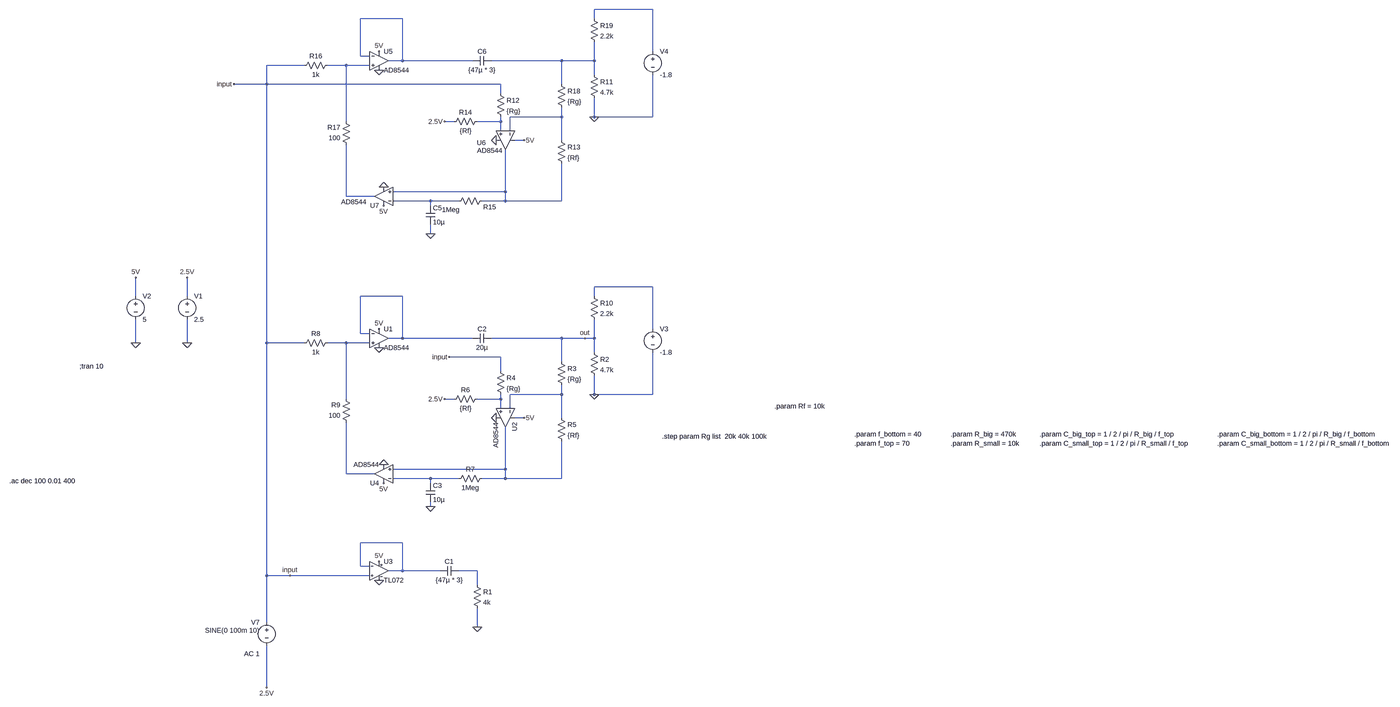
[diagram p0: schematic HP_ac_v2.asc, whole sheet]
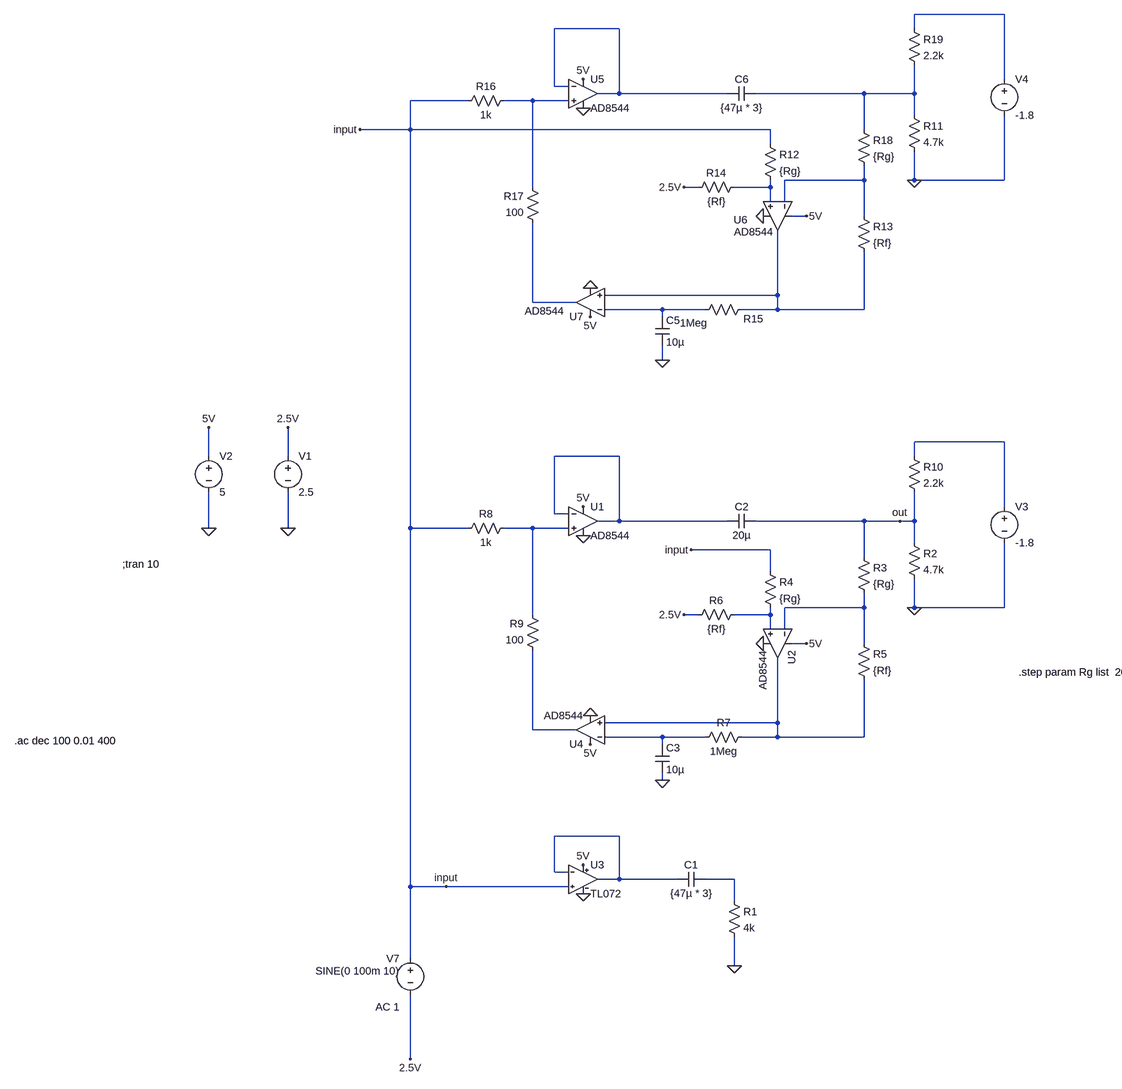
[diagram p1: schematic HP_ac_v2.asc, part, row 1 of 1, column 1 of 2]
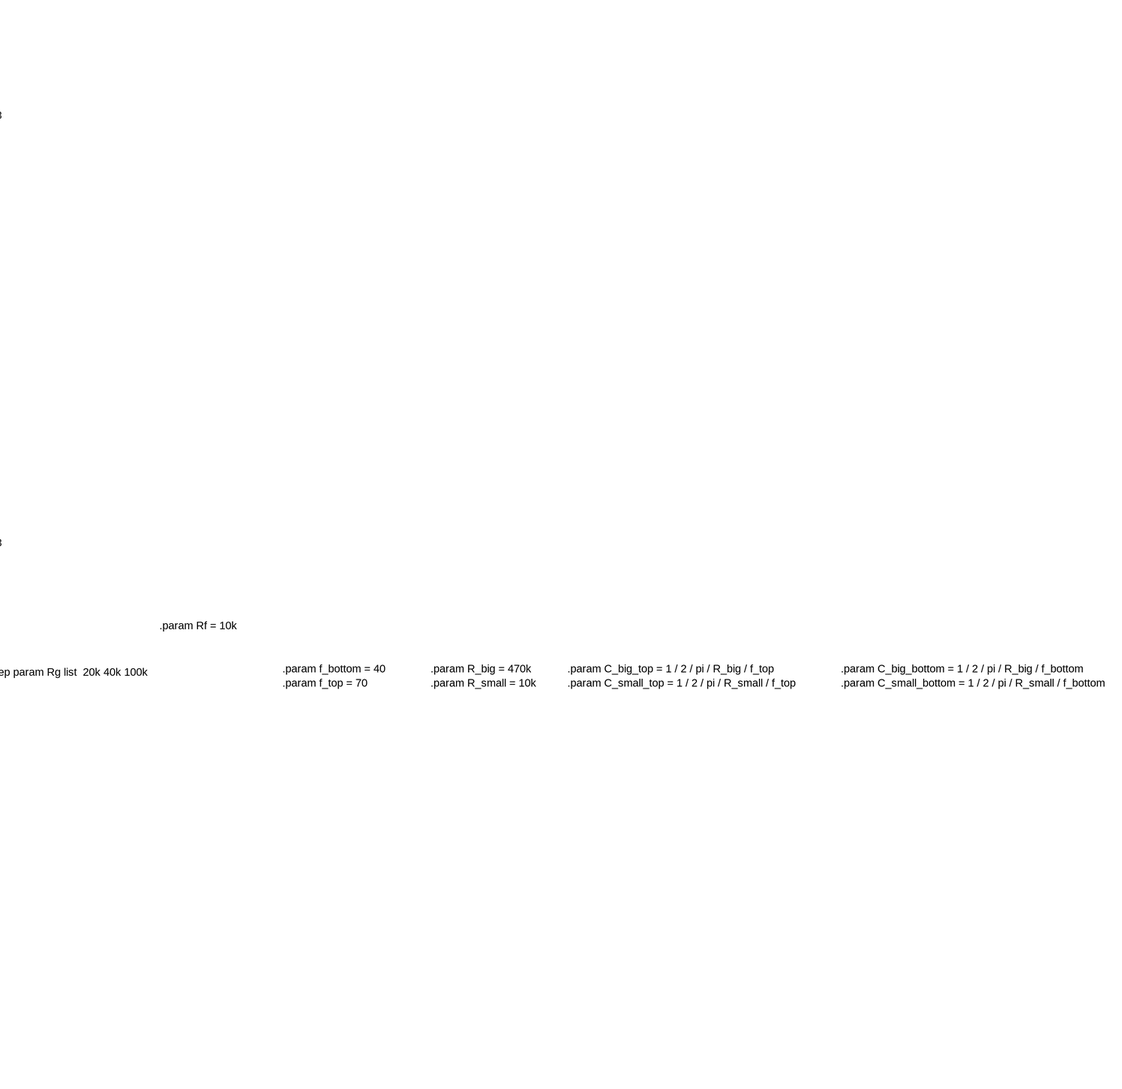
[diagram p2: schematic HP_ac_v2.asc, part, row 1 of 1, column 2 of 2]
HP_ac_v2.asc, the LTspice schematic file:
Version 4
SHEET 1 3144 1716
WIRE 352 -1264 112 -1264
WIRE -544 -1232 -688 -1232
WIRE 112 -1232 112 -1264
WIRE 352 -1120 352 -1264
WIRE -688 -1104 -688 -1232
WIRE -656 -1104 -688 -1104
WIRE -544 -1088 -544 -1232
WIRE -544 -1088 -592 -1088
WIRE -304 -1088 -544 -1088
WIRE 0 -1088 -240 -1088
WIRE 112 -1088 112 -1152
WIRE 112 -1088 0 -1088
WIRE -880 -1072 -1008 -1072
WIRE -736 -1072 -800 -1072
WIRE -656 -1072 -736 -1072
WIRE 112 -1040 112 -1088
WIRE -1008 -1008 -1008 -1072
WIRE -1008 -1008 -1120 -1008
WIRE -208 -1008 -1008 -1008
WIRE 0 -1008 0 -1088
WIRE -208 -976 -208 -1008
WIRE 0 -896 0 -928
WIRE 0 -896 -176 -896
WIRE 112 -896 112 -960
WIRE 112 -896 96 -896
WIRE 352 -896 352 -1040
WIRE 352 -896 112 -896
WIRE -736 -880 -736 -1072
WIRE -368 -880 -400 -880
WIRE -208 -880 -208 -896
WIRE -208 -880 -288 -880
WIRE -208 -848 -208 -880
WIRE -176 -848 -176 -896
WIRE -128 -816 -160 -816
WIRE 0 -816 0 -896
WIRE -192 -640 -192 -784
WIRE -192 -640 -576 -640
WIRE -736 -624 -736 -800
WIRE -640 -624 -736 -624
WIRE -448 -608 -576 -608
WIRE -352 -608 -448 -608
WIRE -192 -608 -192 -640
WIRE -192 -608 -272 -608
WIRE 0 -608 0 -736
WIRE 0 -608 -192 -608
WIRE -448 -592 -448 -608
WIRE -448 -496 -448 -528
WIRE 352 -304 112 -304
WIRE -1456 -272 -1456 -336
WIRE -1280 -272 -1280 -336
WIRE -544 -272 -688 -272
WIRE 112 -272 112 -304
WIRE 352 -160 352 -304
WIRE -688 -144 -688 -272
WIRE -656 -144 -688 -144
WIRE -544 -128 -544 -272
WIRE -544 -128 -592 -128
WIRE -304 -128 -544 -128
WIRE 0 -128 -240 -128
WIRE 80 -128 0 -128
WIRE 112 -128 112 -192
WIRE 112 -128 80 -128
WIRE -1456 -112 -1456 -192
WIRE -1280 -112 -1280 -192
WIRE -1008 -112 -1008 -1008
WIRE -880 -112 -1008 -112
WIRE -736 -112 -800 -112
WIRE -656 -112 -736 -112
WIRE 112 -80 112 -128
WIRE -208 -64 -384 -64
WIRE 0 -48 0 -128
WIRE -208 -16 -208 -64
WIRE 0 64 0 32
WIRE 0 64 -176 64
WIRE 112 64 112 0
WIRE 112 64 96 64
WIRE 352 64 352 -80
WIRE 352 64 112 64
WIRE -736 80 -736 -112
WIRE -368 80 -400 80
WIRE -208 80 -208 64
WIRE -208 80 -288 80
WIRE -208 112 -208 80
WIRE -176 112 -176 64
WIRE -128 144 -160 144
WIRE 0 144 0 64
WIRE -192 320 -192 176
WIRE -192 320 -576 320
WIRE -736 336 -736 160
WIRE -640 336 -736 336
WIRE -448 352 -576 352
WIRE -352 352 -448 352
WIRE -192 352 -192 320
WIRE -192 352 -272 352
WIRE 0 352 0 224
WIRE 0 352 -192 352
WIRE -448 368 -448 352
WIRE -448 448 -448 432
WIRE -544 672 -688 672
WIRE -688 752 -688 672
WIRE -656 752 -688 752
WIRE -544 768 -544 672
WIRE -544 768 -592 768
WIRE -416 768 -544 768
WIRE -288 768 -352 768
WIRE -1008 784 -1008 -112
WIRE -928 784 -1008 784
WIRE -656 784 -928 784
WIRE -288 816 -288 768
WIRE -1008 944 -1008 784
WIRE -288 960 -288 896
WIRE -1008 1184 -1008 1024
FLAG -1456 -112 0
FLAG -1456 -336 5V
FLAG -1280 -112 0
FLAG -1280 -336 2.5V
FLAG -624 800 0
FLAG -624 736 5V
FLAG -1008 1184 2.5V
FLAG -288 960 0
FLAG -624 -96 0
FLAG -624 -160 5V
FLAG 112 64 0
FLAG -928 784 input
FLAG 80 -128 out
FLAG -224 144 0
FLAG -128 144 5V
FLAG -384 -64 input
FLAG -400 80 2.5V
FLAG -448 448 0
FLAG -608 304 0
FLAG -608 368 5V
FLAG -624 -1056 0
FLAG -624 -1120 5V
FLAG 112 -896 0
FLAG -224 -816 0
FLAG -128 -816 5V
FLAG -1120 -1008 input
FLAG -400 -880 2.5V
FLAG -448 -496 0
FLAG -608 -656 0
FLAG -608 -592 5V
SYMBOL voltage -1456 -288 R0
WINDOW 123 0 0 Left 0
WINDOW 39 0 0 Left 0
SYMATTR InstName V2
SYMATTR Value 5
SYMBOL voltage -1008 928 M0
WINDOW 123 24 124 Left 2
WINDOW 39 0 0 Left 0
WINDOW 3 24 44 Left 2
SYMATTR Value2 AC 1
SYMATTR Value SINE(0 100m 10)
SYMATTR InstName V7
SYMBOL voltage -1280 -288 R0
WINDOW 123 0 0 Left 0
WINDOW 39 0 0 Left 0
SYMATTR InstName V1
SYMATTR Value 2.5
SYMBOL ZZZ\\OpAmp\\TL072 -624 768 R0
SYMATTR InstName U3
SYMBOL cap -352 752 R90
WINDOW 0 0 32 VBottom 2
WINDOW 3 32 32 VTop 2
SYMATTR InstName C1
SYMATTR Value {47µ * 3}
SYMBOL res -304 800 R0
SYMATTR InstName R1
SYMATTR Value 4k
SYMBOL cap -240 -144 R90
WINDOW 0 0 32 VBottom 2
WINDOW 3 32 32 VTop 2
SYMATTR InstName C2
SYMATTR Value 20µ
SYMBOL res 96 -96 R0
SYMATTR InstName R2
SYMATTR Value 4.7k
SYMBOL OpAmps\\AD8544 -624 -192 R0
SYMATTR InstName U1
SYMBOL OpAmps\\AD8544 -128 144 R90
SYMATTR InstName U2
SYMBOL res -224 -32 R0
SYMATTR InstName R4
SYMATTR Value {Rg}
SYMBOL res -16 128 R0
SYMATTR InstName R5
SYMATTR Value {Rf}
SYMBOL res -272 64 R90
WINDOW 0 0 56 VBottom 2
WINDOW 3 32 56 VTop 2
SYMATTR InstName R6
SYMATTR Value {Rf}
SYMBOL res -256 336 R90
WINDOW 0 0 56 VBottom 2
WINDOW 3 32 56 VTop 2
SYMATTR InstName R7
SYMATTR Value 1Meg
SYMBOL cap -464 368 R0
SYMATTR InstName C3
SYMATTR Value 10µ
SYMBOL OpAmps\\AD8544 -608 400 R180
SYMATTR InstName U4
SYMBOL res -784 -128 R90
WINDOW 0 0 56 VBottom 2
WINDOW 3 32 56 VTop 2
SYMATTR InstName R8
SYMATTR Value 1k
SYMBOL res -720 176 R180
WINDOW 0 36 76 Left 2
WINDOW 3 36 40 Left 2
SYMATTR InstName R9
SYMATTR Value 100
SYMBOL res -16 -64 R0
SYMATTR InstName R3
SYMATTR Value {Rg}
SYMBOL res 96 -288 R0
SYMATTR InstName R10
SYMATTR Value 2.2k
SYMBOL voltage 352 -176 R0
WINDOW 123 0 0 Left 0
WINDOW 39 0 0 Left 0
SYMATTR InstName V3
SYMATTR Value -1.8
SYMBOL res 96 -1056 R0
SYMATTR InstName R11
SYMATTR Value 4.7k
SYMBOL OpAmps\\AD8544 -624 -1152 R0
SYMATTR InstName U5
SYMBOL OpAmps\\AD8544 -128 -816 R90
WINDOW 0 9 131 VRight 2
WINDOW 3 35 74 VRight 2
SYMATTR InstName U6
SYMBOL res -224 -992 R0
SYMATTR InstName R12
SYMATTR Value {Rg}
SYMBOL res -16 -832 R0
SYMATTR InstName R13
SYMATTR Value {Rf}
SYMBOL res -272 -896 R90
WINDOW 0 0 56 VBottom 2
WINDOW 3 32 56 VTop 2
SYMATTR InstName R14
SYMATTR Value {Rf}
SYMBOL res -256 -624 R90
WINDOW 0 52 -10 VBottom 2
WINDOW 3 30 122 VTop 2
SYMATTR InstName R15
SYMATTR Value 1Meg
SYMBOL cap -464 -592 R0
SYMATTR InstName C5
SYMATTR Value 10µ
SYMBOL OpAmps\\AD8544 -608 -560 R180
WINDOW 3 59 45 Left 2
SYMATTR InstName U7
SYMBOL res -784 -1088 R90
WINDOW 0 0 56 VBottom 2
WINDOW 3 32 56 VTop 2
SYMATTR InstName R16
SYMATTR Value 1k
SYMBOL res -720 -784 R180
WINDOW 0 36 76 Left 2
WINDOW 3 36 40 Left 2
SYMATTR InstName R17
SYMATTR Value 100
SYMBOL res -16 -1024 R0
SYMATTR InstName R18
SYMATTR Value {Rg}
SYMBOL res 96 -1248 R0
SYMATTR InstName R19
SYMATTR Value 2.2k
SYMBOL voltage 352 -1136 R0
WINDOW 123 0 0 Left 0
WINDOW 39 0 0 Left 0
SYMATTR InstName V4
SYMATTR Value -1.8
SYMBOL cap -240 -1104 R90
WINDOW 0 0 32 VBottom 2
WINDOW 3 32 32 VTop 2
SYMATTR InstName C6
SYMATTR Value {47µ * 3}
TEXT -1648 -32 Left 2 !;tran 10
TEXT -1888 360 Left 2 !.ac dec 100 0.01 400
TEXT 1216 200 Left 2 !.param f_bottom = 40
TEXT 1216 232 Left 2 !.param f_top = 70
TEXT 1552 200 Left 2 !.param R_big = 470k
TEXT 1552 232 Left 2 !.param R_small = 10k
TEXT 1856 200 Left 2 !.param C_big_top = 1 / 2 / pi / R_big / f_top
TEXT 1856 232 Left 2 !.param C_small_top = 1 / 2 / pi / R_small / f_top
TEXT 2472 200 Left 2 !.param C_big_bottom = 1 / 2 / pi / R_big / f_bottom
TEXT 2472 232 Left 2 !.param C_small_bottom = 1 / 2 / pi / R_small / f_bottom
TEXT 384 208 Left 2 !.step param Rg list  20k 40k 100k
TEXT 768 104 Left 2 !.param Rf = 10k

The netlist it stands for:
* HP_ac_v2.asc
V2 5V 0 5
V7 input 2.5V SINE(0 100m 10) AC 1
V1 2.5V 0 2.5
XU3 input N018 5V 0 N018 TL072  ; pins 1 2 3 4 5
C1 N019 N018 {47µ * 3}
R1 N019 0 4k
C2 out N011 20µ
R2 out 0 4.7k
XU1 N012 N011 5V 0 N011 AD8544  ; pins In+ In- V+ V- OUT
XU2 N014 N013 5V 0 N015 AD8544  ; pins In+ In- V+ V- OUT
R4 input N014 {Rg}
R5 N013 N015 {Rf}
R6 N014 2.5V {Rf}
R7 N015 N017 1Meg
C3 N017 0 10µ
XU4 N015 N017 5V 0 N016 AD8544  ; pins In+ In- V+ V- OUT
R8 N012 input 1k
R9 N016 N012 100
R3 out N013 {Rg}
R10 N010 out 2.2k
V3 N010 0 -1.8
R11 N003 0 4.7k
XU5 N004 N002 5V 0 N002 AD8544  ; pins In+ In- V+ V- OUT
XU6 N006 N005 5V 0 N007 AD8544  ; pins In+ In- V+ V- OUT
R12 input N006 {Rg}
R13 N005 N007 {Rf}
R14 N006 2.5V {Rf}
R15 N007 N009 1Meg
C5 N009 0 10µ
XU7 N007 N009 5V 0 N008 AD8544  ; pins In+ In- V+ V- OUT
R16 N004 input 1k
R17 N008 N004 100
R18 N003 N005 {Rg}
R19 N001 N003 2.2k
V4 N001 0 -1.8
C6 N003 N002 {47µ * 3}
;tran 10
.ac dec 100 0.01 400
.param f_bottom = 40
.param f_top = 70
.param R_big = 470k
.param R_small = 10k
.param C_big_top = 1 / 2 / pi / R_big / f_top
.param C_small_top = 1 / 2 / pi / R_small / f_top
.param C_big_bottom = 1 / 2 / pi / R_big / f_bottom
.param C_small_bottom = 1 / 2 / pi / R_small / f_bottom
.step param Rg list  20k 40k 100k
.param Rf = 10k
.lib TL072.cir
.backanno
.end